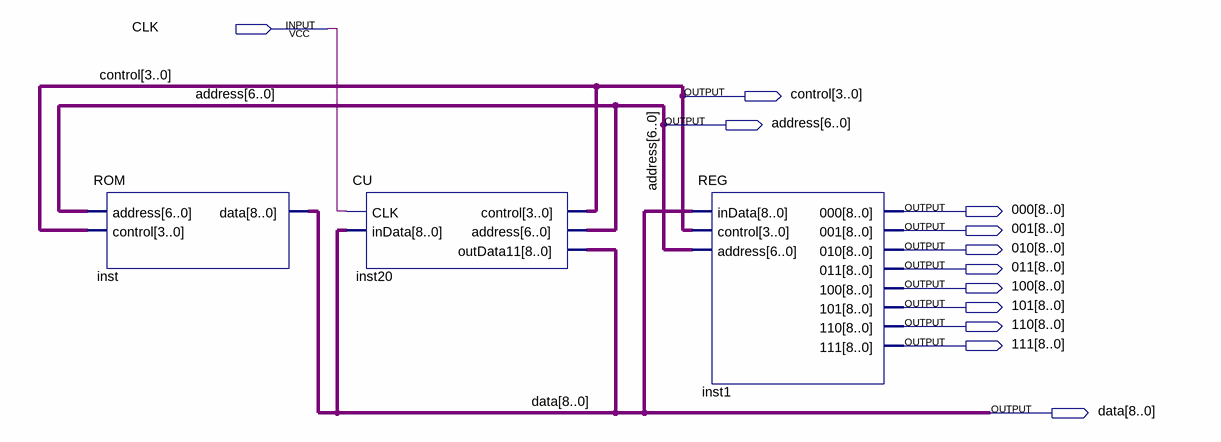
[diagram p0: schematic sheet]
// Quartus schematic Lab4.bdf as structural Verilog: 3 symbols, 12 pins
module Lab4 (
  input  CLK,
  output [3:0] control,
  output [6:0] address,
  output [8:0] \000 ,
  output [8:0] \001 ,
  output [8:0] \010 ,
  output [8:0] \011 ,
  output [8:0] \100 ,
  output [8:0] \101 ,
  output [8:0] \110 ,
  output [8:0] \111 ,
  output [8:0] data
);

  ROM inst (.address(address), .control(control), .data(data));
  CU inst20 (.CLK(CLK), .inData(data), .control(control), .address(address), .outData11(data));
  REG inst1 (
    .inData(data), .control(control), .address(address), .\000 (\000 ), .\001 (\001 ), .\010 (\010 ),
    .\011 (\011 ), .\100 (\100 ), .\101 (\101 ), .\110 (\110 ), .\111 (\111 ));
endmodule
